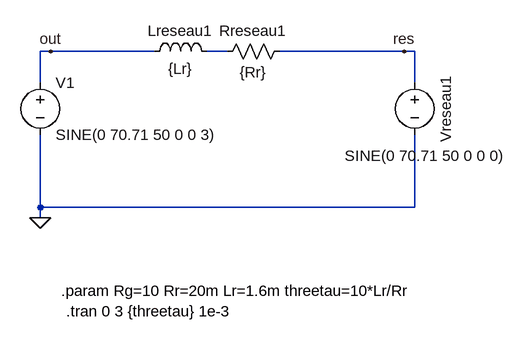
[diagram p0: schematic TRANSFERTPUISSANCE.asc]
TRANSFERTPUISSANCE.asc, the LTspice schematic file:
Version 4
SHEET 1 880 680
WIRE -112 16 -128 16
WIRE 48 16 -112 16
WIRE 160 16 128 16
WIRE 432 16 240 16
WIRE 448 16 432 16
WIRE -128 64 -128 16
WIRE 448 64 448 16
WIRE -128 256 -128 144
WIRE 448 256 448 144
WIRE 448 256 -128 256
WIRE -128 272 -128 256
FLAG 432 16 res
FLAG -128 272 0
FLAG -112 16 out
SYMBOL voltage 448 48 R0
WINDOW 0 32 56 VTop 2
WINDOW 3 16 144 Bottom 2
WINDOW 123 0 0 Left 0
WINDOW 39 0 0 Left 0
SYMATTR InstName Vreseau1
SYMATTR Value SINE(0 70.71 50 0 0 0)
SYMBOL voltage -128 48 R0
WINDOW 123 0 0 Left 0
WINDOW 39 0 0 Left 0
SYMATTR InstName V1
SYMATTR Value SINE(0 70.71 50 0 0 3)
SYMBOL res 256 0 R90
WINDOW 0 0 56 VBottom 2
WINDOW 3 32 56 VTop 2
SYMATTR InstName Rreseau1
SYMATTR Value {Rr}
SYMBOL ind 32 32 R270
WINDOW 0 32 56 VTop 2
WINDOW 3 5 56 VBottom 2
SYMATTR InstName Lreseau1
SYMATTR Value {Lr}
TEXT -96 384 Left 2 !.param Rg=10 Rr=20m Lr=1.6m threetau=10*Lr/Rr
TEXT -88 416 Left 2 !.tran 0 3 {threetau} 1e-3

The netlist it stands for:
* TRANSFERTPUISSANCE.asc
Vreseau1 res 0 SINE(0 70.71 50 0 0 0)
V1 out 0 SINE(0 70.71 50 0 0 3)
Rreseau1 res N001 {Rr}
Lreseau1 out N001 {Lr}
.param Rg=10 Rr=20m Lr=1.6m threetau=10*Lr/Rr
.tran 0 3 {threetau} 1e-3
.backanno
.end